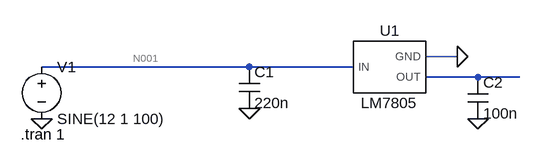
[diagram p0: schematic power.asc]
power.asc, the LTspice schematic file:
Version 4.1
SHEET 1 880 680
WIRE 432 128 384 128
WIRE 112 144 -208 144
WIRE 272 144 112 144
WIRE 464 160 384 160
WIRE 528 160 464 160
FLAG -208 224 0
FLAG 432 128 0
FLAG 112 208 0
FLAG 464 224 0
SYMBOL voltage -208 128 R0
WINDOW 123 0 0 Left 0
WINDOW 39 0 0 Left 0
SYMATTR InstName V1
SYMATTR Value SINE(12 1 100)
SYMBOL LM7805 320 144 R0
SYMATTR InstName U1
SYMBOL cap 96 144 R0
SYMATTR InstName C1
SYMATTR Value 220n
SYMBOL cap 448 160 R0
SYMATTR InstName C2
SYMATTR Value 100n
TEXT -240 248 Left 2 !.tran 1

The netlist it stands for:
* power.asc
V1 N001 0 SINE(12 1 100)
X§U1 N001 0 N002 LM7805  ; pins IN GND OUT
C1 N001 0 220n
C2 N002 0 100n
.tran 1
.lib power1.lib
.backanno
.end

* Results of the author's LTspice run, read from the files saved beside the schematic
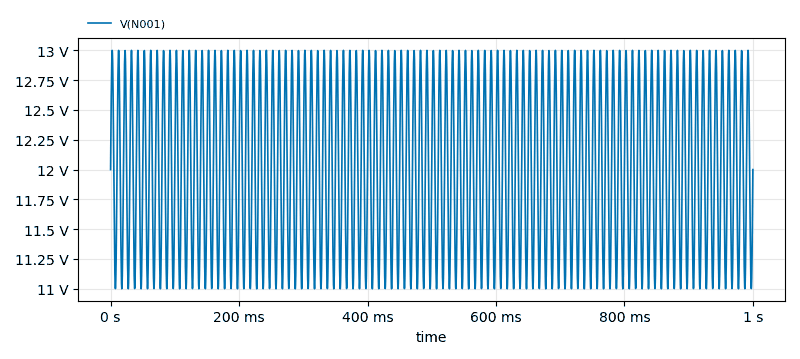
[diagram p1: Transient Analysis of power.asc, plotted from the saved traces]
* Transient Analysis, 1 run:
*   V(N001): min 11 V, max 13 V, average 12 V, rms 12.02 V, last 12 V